# Altium schematic sheet Memory_EEPROM.SchDoc
size A4
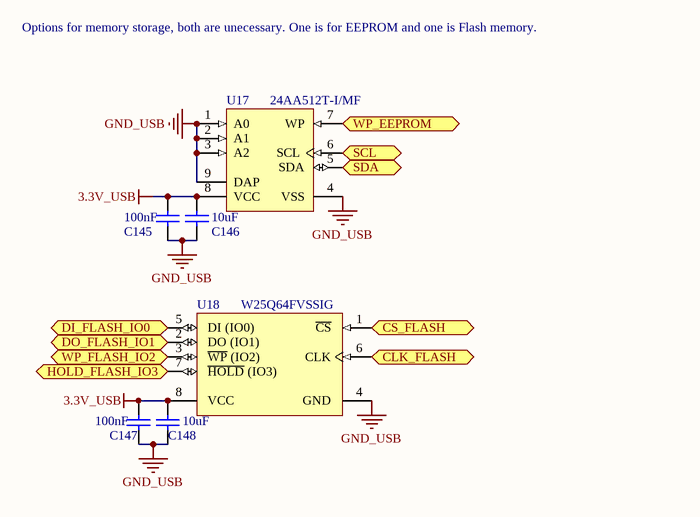
[diagram p0: Memory_EEPROM.SchDoc]

## Parts
C145  value 100nF  [CAPC0402(1005)60_L]  (hidden comment: CAP0402)
C146  value 10uF  [CAPC0402(1005)60_L]  (hidden comment: CAP0402)
C147  value 100nF  [CAPC0402(1005)60_L]  (hidden comment: CAP0402)
C148  value 10uF  [CAPC0402(1005)60_L]  (hidden comment: CAP0402)
U17  24AA512T-I/MF  [DFNS-MF8]
U18  W25Q64FVSSIG  [WINB-SOIC-8_M]

## Ports
CLK_FLASH (in), CS_FLASH (in), DI_FLASH_IO0 (bidir), DO_FLASH_IO1 (bidir), HOLD_FLASH_IO3 (bidir), SCL (in), SDA (bidir), WP_EEPROM (in), WP_FLASH_IO2 (bidir)

## Nets
3.3V_USB: C145.1 C146.1 C147.1 C148.1 U17.8(VCC) U18.8(VCC)
GND_USB: C145.2 C146.2 C147.2 C148.2 U17.1(A0) U17.2(A1) U17.3(A2) U17.4(VSS) U17.9(DAP) U18.4(GND)
CLK_FLASH: U18.6(CLK) ; port CLK_FLASH
CS_FLASH: U18.1(~{CS}) ; port CS_FLASH
DI_FLASH_IO0: U18.5(DI_(IO0)) ; port DI_FLASH_IO0
DO_FLASH_IO1: U18.2(DO_(IO1)) ; port DO_FLASH_IO1
HOLD_FLASH_IO3: U18.7(~{HOLD}_(IO3)) ; port HOLD_FLASH_IO3
SCL: U17.6(SCL) ; port SCL
SDA: U17.5(SDA) ; port SDA
WP_EEPROM: U17.7(WP) ; port WP_EEPROM
WP_FLASH_IO2: U18.3(~{WP}_(IO2)) ; port WP_FLASH_IO2

## Notes on the sheet
- Options for memory storage, both are unecessary. One is for EEPROM and one is Flash memory.

## Library data of the parts
C145-C148 = CMP-1590-00004-1: 0402 (1005 Metric) Chip Capacitor; Case-EIA: 0402; Case-Metric: 1005; PackageReference: CAPC0402(1005)60
U17 = CMP-0159-00362-1: 512Kbit, 400kHz, 1.8V, I2C Serial EEPROM, 8-Pin DFN, Industrial Temperature, Tape and Reel; PackageDescription: 8-Lead Plastic Dual Flat, No Lead Package (MF) - 6x5 mm Body [DFN-S]; DatasheetVersion: revJ, Jul-2008; PackageVersion: revBB, Aug-2009; PackageReference: DFNS-MF8
U18 = CMP-2000-05007-1: 3V 64M-Bit Serial Flash Memory with Dual/Quad SPI & QPI, 2.7 to 3.6 V, -40 to 85 degC, 8-Pin SOIC, RoHS, Tape and Reel; Manufacturer: Winbond; Boot Type: Bottom/Top; Word Size: 8b; Cell Type: NOR; Operating Supply Voltage (Min): 2.7V; Operating Supply Voltage (Max): 3.6V; Rad Hardened: No; Density: 67108864Bit; Address Bus: 1b; Supply Current: 40mA; Sync/Async: Synchronous; Number of Words: 8M; Programmable: Yes; Operating Supply Voltage (Typ): 3/3.3V; Access Time (Max): 8.5ns; Interface Type: Serial(SPI); Operating Temperature Classification: Industrial; Datasheet Version: Rev. D, 12/2011; Operating Temp Range: -40Cto85C; Operating Temperature (Max): 85C; Pin Count: 8; Mounting: SurfaceMount; Program/Erase Volt (Typ): 2.7to3.6V; Operating Temperature (Min): -40C; Package Description: 8-Pin Small Outline Integrated Circuit, Body 5.28 x 5.28 mm, Pitch 1.27 mm; Datasheet URL: https://datasheet.ciiva.com/15126/getdatasheetpartid-552937-15126648.pdf; Package Reference: SS-8; Manufacturer URL: http://www.winbond.com/hq/index.html?__locale=en; Package Type: SOIC